# EasyEDA Pro project EasyEda_Gateway.eprj

# Schematic Schematic1
Board Name: Board1; Create Date: 2024-10-11
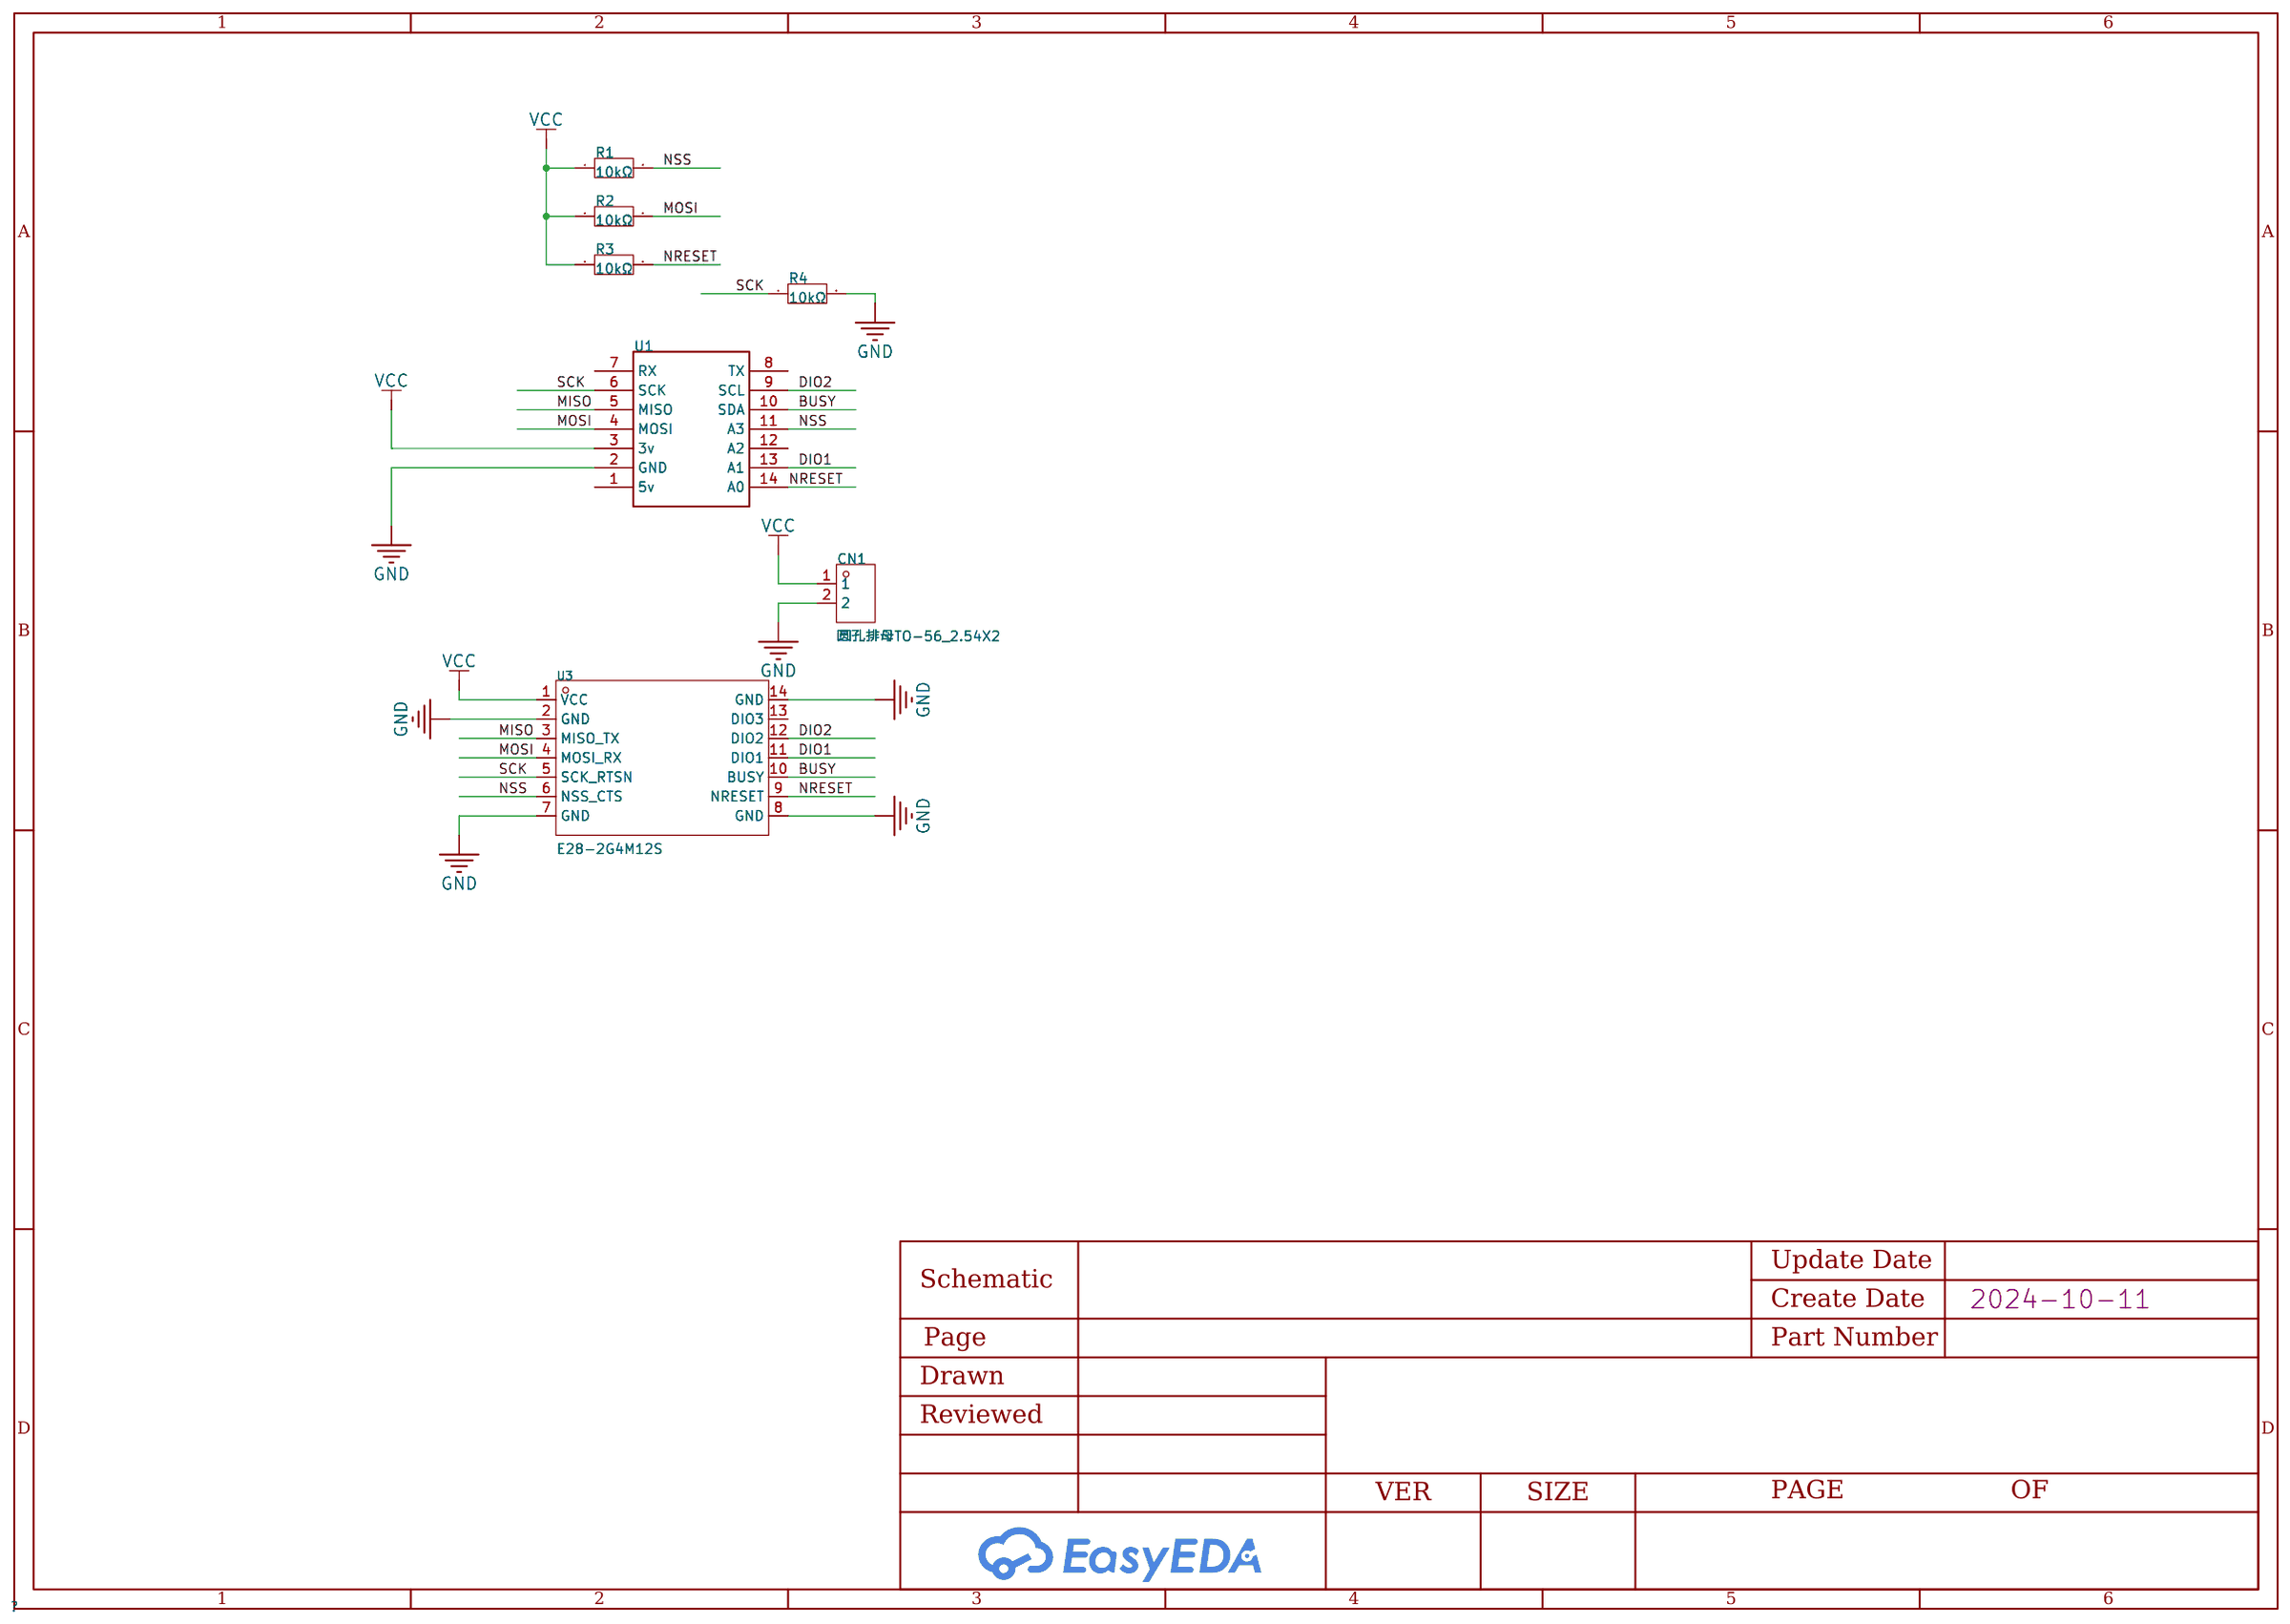
[diagram p0: schematic sheet]

## Parts
CN1  圆孔排母TO-56_2.54X2  [CONN-TH_TO-56_2.54-2]
R1  10kΩ  [R0603]
R2  10kΩ  [R0603]
R3  10kΩ  [R0603]
R4  10kΩ  [R0603]
U1  =ESP32-qtpy  [esp32-s2_qtpy]
U3  E28-2G4M12S  [WIRELM-SMD_E28-2G4M12S]

## Library data of the parts
CN1 = 圆孔排母TO-56_2.54X2: Supplier Part: C9900002039; Supplier Footprint: TH-2_2.54X5.08X2.54P; Supplier: LCSC
R1-R4 = RMCF0603FT1K00: Type:Thick Film Resistors Resistance: Tolerance:±1% Tolerance:±1% Power(Watts): Temperature Coefficient:±100ppm/℃ Temperature Coefficient:±100ppm/℃ Overload Voltage (Max): Operating Temperature Range:-55℃~+155℃ Operating Temperature Range:-55℃~+155℃; LCSC Part Name: 10kΩ ±1% 100mW; Supplier Part: C2484712; Manufacturer: SEI(Stackpole Electronics Inc.); Supplier Footprint: 0603; JLCPCB Part Class: Extended Part; Datasheet: https://atta.szlcsc.com/upload/public/pdf/source/20210416/08FD20E6270D8D7CE8DA16B611AFBC44.pdf; Supplier: LCSC; Type: Thick Film Resistors; Tolerance: ±1%; Temperature Coefficient: ±100ppm/℃; Operating Temperature Range: -55℃~+155℃
U1 = esp32-s2_qtpy
U3 = E28-2G4M12S: Supplier Part: C411310; Manufacturer: EBYTE(亿佰特); Supplier Footprint: SMD,14x25mm; JLCPCB Part Class: Extended Part; Datasheet: https://atta.szlcsc.com/upload/public/pdf/source/20190812/C411310_35CC255654AEA531A1D9F26CF905C5EF.pdf; Supplier: LCSC

## Nets
GND: CN1.2 R4.2 U1.2(GND) U3.2(GND) U3.7(GND) U3.8(GND) U3.14(GND)
VCC: CN1.1 R1.1 R2.1 R3.1 U1.3(3v) U3.1(VCC)
BUSY: U1.10(SDA) U3.10(BUSY)
DIO1: U1.13(A1) U3.11(DIO1)
DIO2: U1.9(SCL) U3.12(DIO2)
MISO: U1.5(MISO) U3.3(MISO_TX)
MOSI: R2.2 U1.4(MOSI) U3.4(MOSI_RX)
NRESET: R3.2 U1.14(A0) U3.9(NRESET)
NSS: R1.2 U1.11(A3) U3.6(NSS_CTS)
SCK: R4.1 U1.6(SCK) U3.5(SCK_RTSN)

Not connected (* = marked no-connect by the designer): U1 1(5v) 7(RX) 8(TX) 12(A2); U3 13(DIO3)

# Board PCB1
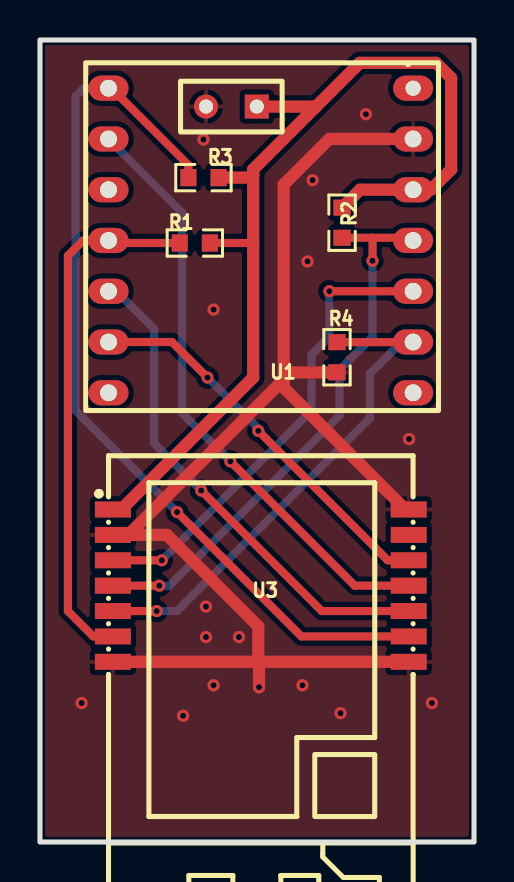
[diagram p1: board, top side]
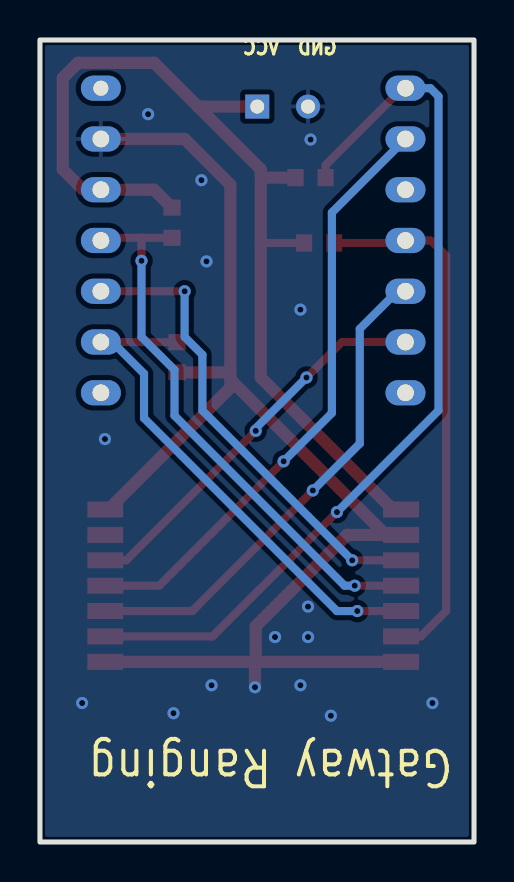
[diagram p2: board, bottom side, seen from below]

Outline 21.72 x 40.13 mm; copper layers: Top Layer, Bottom Layer. Coordinates in mm from the lower left corner of the outline.
Outline path: rectangle 0,40.13 21.72,0
Stack: Top Layer 0.035mm / Dielectric1 1.51mm FR4 er 4.5 / Bottom Layer 0.035mm

## Design rules (mm)
template: JLCPCB Capability(Two Layers Board)
spacing copperThickness1oz (default): track to track 0.102, other pairs 0.152 to 0.3
spacing copperThickness2oz: track to track 0.203, other pairs 0.152 to 0.3
track width copperThickness1oz (default): min 0.127, default 0.254, max 2.54
track width copperThickness2oz: min 0.203, default 0.254, max 2.54
differential pair differentialPair (default): width min 0.127, default 0.254, max 2.54; gap min 0.152, default 0.152
via viaSize (default): diameter min 0.5, default 0.61, max 10; hole min 0.3, default 0.305, max 6.3

## Placement (name value [footprint] x y rotation side)
GND  VCC  -  [CONN-TH_TO-56_2.54-2]  9.58 36.8 180 top
R1  10kΩ  [R0603]  7.75 29.97 180 top
R2  10kΩ  [R0603]  15.11 30.99 270 top
R3  10kΩ  [R0603]  8.18 33.24 180 top
R4  10kΩ  [R0603]  14.86 24.26 270 top
U1  =ESP32-qtpy  [esp32-s2_qtpy]  10.92 30.23 180 top
U3  E28-2G4M12S  [WIRELM-SMD_E28-2G4M12S]  11.05 12.83 0 top

## Footprints (pads in the part's own frame, mm; a bottom-side part is the same pattern mirrored in y, then rotated)
CONN-TH_TO-56_2.54-2
  rect 1.2x1.2 hole 0.7: 1(-1.27,0)
  round 1.2 hole 0.7: 2(1.27,0)
esp32-s2_qtpy
  oval 2x1.26 hole 0.756: 1(-7.747,-7.493)
  oval 2x1.26 hole 0.84: 2(-7.747,-4.953) 3(-7.747,-2.413) 4(-7.747,0.127) 5(-7.747,2.667) 6(-7.747,5.207) 7(-7.747,7.747) 8(7.493,7.747) 9(7.493,5.207) 10(7.493,2.667) 11(7.493,0.127) 12(7.493,-2.413) 13(7.493,-4.953) 14(7.493,-7.493)
R0603
  rect 0.806x0.864 smd: 1(-0.753,0) 2(0.753,0)
WIRELM-SMD_E28-2G4M12S
  rect 1.8x0.8 smd: 1(-7.4,3.81) 2(-7.4,2.54) 3(-7.4,1.27) 4(-7.4,0) 5(-7.4,-1.27) 6(-7.4,-2.54) 7(-7.4,-3.81) 8(7.4,-3.81) 9(7.4,-2.54) 10(7.4,-1.27) 11(7.4,0) 12(7.4,1.27) 13(7.4,2.54) 14(7.4,3.81)

## Nets
As in the schematic, except:
GND: GND  VCC.2 R4.2 U1.2 U3.2 U3.7 U3.8 U3.14
VCC: GND  VCC.1 R1.1 R2.1 R3.1 U1.3 U3.1

Pads without a net: U1 1 7 8 12; U3 13

## Via types
v1: diameter 0.61, hole 0.305, Top Layer to Bottom Layer, 26 vias

## Routing (per net, layer and track width the routed paths; a pad name or vN(x,y) marks a point on that pad's centre or on a via; arc(x,y) is an arc through that point)
GND: length 67.1
  Top Layer w0.61: 12.19,23.49 14.85,23.49 R4.2 ; 12.19,23.49 12.19,23.24 ; 12.19,23.49 12.19,32.89 14.48,35.18 U1.2 ; U3.14 18.29,16.64 12.19,22.73 12.19,23.24 ; 12.19,23.24 12.06,23.01 4.42,15.37 ; 4.42,15.37 6.35,15.37 10.92,10.79 10.92,9.05 10.96,9.02 ; 4.42,15.37 U3.2 ; 10.96,9.02 v1(10.96,7.75) ; 10.96,9.02 U3.7 ; 10.96,9.02 U3.8
  vias: v1(2.08,6.95) v1(7.16,6.32) v1(8.18,35.15) v1(8.31,11.78) v1(8.31,10.26) v1(8.69,26.64) v1(8.69,7.84) v1(9.96,10.26) v1(13.13,7.84) v1(13.39,29.05) v1(13.64,33.12) v1(15.04,6.45) v1(16.31,36.42) v1(18.47,20.16) v1(19.61,6.95)
VCC: length 50.3
  Top Layer w0.406: R1.1 10.67,29.97
  Top Layer w0.61: 10.67,33.37 10.67,33.66 13.78,36.77 ; 10.67,33.37 10.54,33.24 R3.1 ; 10.67,33.37 10.67,23.24 4.06,16.64 U3.1 ; 13.78,36.77 13.75,36.8 GND  VCC.1 ; 13.78,36.77 16,38.99 19.81,38.99 20.57,38.23 20.57,33.66 19.56,32.64 U1.3 16.01,32.64 R2.1
BUSY: length 25
  Top Layer w0.406: v1(8.06,17.59) 14.1,11.56 18.45,11.56
  Bottom Layer w0.406: U1.10 3.83,27.56 5.72,25.67 5.72,19.94 v1(8.06,17.59)
DIO1: length 30.2
  Top Layer w0.406: U3.11 15.75,12.83 v1(9.53,19.05)
  Bottom Layer w0.406: v1(9.53,19.05) 7.11,21.46 7.11,31.5 U1.13
DIO2: length 19.6
  Top Layer w0.406: U3.12 17.4,14.1 v1(10.92,20.57) ; U1.9 6.6,25.02 v1(8.38,23.24)
  Bottom Layer w0.406: v1(8.38,23.24) 10.92,20.7 v1(10.92,20.57)
MISO: length 23.6
  Top Layer w0.406: U1.5 v1(14.48,27.56) ; v1(6.1,14.1) U3.3
  Bottom Layer w0.406: v1(14.48,27.56) 14.48,25.27 13.59,24.38 13.59,21.59 v1(6.1,14.1)
MOSI: length 28.1
  Top Layer w0.406: 16.62,30.23 18.53,30.23 U1.4 ; 16.62,30.23 16.64,30.22 v1(16.64,29.08) ; 16.62,30.23 15.11,30.23 ; v1(5.97,12.83) U3.4
  Bottom Layer w0.406: v1(5.97,12.83) 6.48,12.83 14.99,21.34 14.99,23.62 16.64,25.27 v1(16.64,29.08)
NRESET: length 45.1
  Top Layer w0.406: v1(6.86,16.51) 13.08,10.29 U3.9 ; U1.14 3.58,37.72 7.43,33.87 R3.2
  Bottom Layer w0.406: v1(6.86,16.51) 1.78,21.59 1.78,37.31 2.18,37.72 U1.14
NSS: length 26.5
  Top Layer w0.406: U3.6 2.67,10.29 1.4,11.56 1.4,29.34 2.16,30.1 U1.11 3.56,29.97 6.99,29.97
SCK: length 25.7
  Top Layer w0.406: U1.6 18.66,25.01 R4.1 ; v1(5.84,11.56) 3.65,11.56
  Bottom Layer w0.406: U1.6 18.09,25.02 16.51,23.43 16.51,21.21 6.86,11.56 v1(5.84,11.56)

## Copper pours and planes (outline as drawn; the poured copper is in the pictures)
GND on Top Layer: 0,40.13 21.72,40.13 21.72,0 0,0
GND on Bottom Layer: 0,40.13 21.49,40.13 21.49,0 0,0

## Text on the board
Bottom Silkscreen Layer: Gatway Ranging
